# EAGLE design GridEYE-Breakout (EAGLE 6.3)
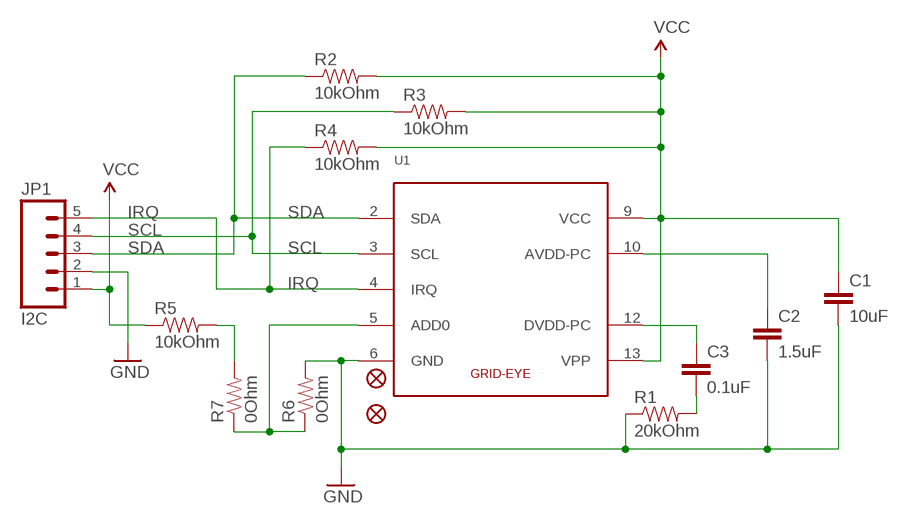
[diagram p0: schematic, sheet 1]

## Parts
C1  10uF  CAP0603-CAP  [0603-CAP]
C2  1.5uF  CAP0603-CAP  [0603-CAP]
C3  0.1uF  CAP0603-CAP  [0603-CAP]
JP1  I2C  M05PTH  [1X05]
JP2  FIDUCIAL1X2  [FIDUCIAL-1X2]
JP3  FIDUCIAL1X2  [FIDUCIAL-1X2]
R1  20kOhm  RESISTOR0603-RES  [0603-RES]
R2  10kOhm  RESISTOR0603-RES  [0603-RES]
R3  10kOhm  RESISTOR0603-RES  [0603-RES]
R4  10kOhm  RESISTOR0603-RES  [0603-RES]
R5  10kOhm  RESISTOR0603-RES  [0603-RES]
R6  0Ohm  RESISTOR0402-RES  [0402-RES]
R7  0Ohm  RESISTOR0402-RES  [0402-RES]
U1  GRID-EYE  [GRID-EYE]

## Nets
ADD0: R6.1 R7.1 U1.5(ADD0)
AVDD: C2.1 U1.10(AVDD-PC)
DVDD: C3.1 U1.12(DVDD-PC)
GND: C1.2 C2.2 JP1.2 R1.1 R6.2 U1.6(GND)
IRQ: JP1.5 R4.1 U1.4(IRQ)
N$2: R5.2 R7.2
N$3: C3.2 R1.2
SCL: JP1.4 R3.1 U1.3(SCL)
SDA: JP1.3 R2.1 U1.2(SDA)
VCC: C1.1 JP1.1 R2.2 R3.2 R4.2 R5.1 U1.9(VCC) U1.13(VPP)

## Library data of the parts
C1-C3 = SparkFun-Capacitors:CAP: Capacitor Standard 0603 ceramic capacitor, and 0.1" leaded capacitor.
JP1 = SparkFun-Connectors:M05: Header 5 Standard 5-pin 0.1" header. Use with straight break away headers (SKU : PRT-00116), right angle break away headers (PRT-00553), swiss pins (PRT-00743), machine pins (PRT-00117), and female headers (PRT-00115). Molex polarized connector foot print use with SKU : PRT-08230 with associated crimp pins and housings.
JP2 JP3 = SparkFun-Aesthetics:FIDUCIAL: Fiducial Alignment Points Various fiducial points for machine vision alignment.
R1-R7 = SparkFun-Resistors:RESISTOR: Resistor Basic schematic elements and footprints for 0603, 1206, and PTH resistors.
U1 = logxen:GRID-EYE

## Board
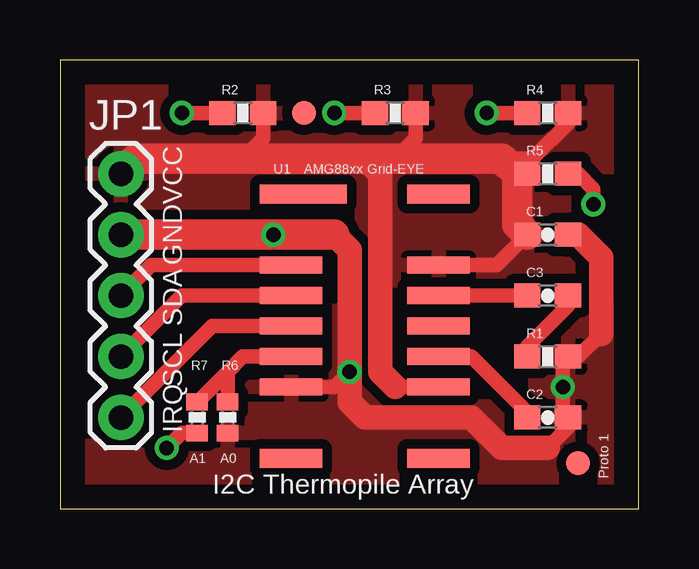
[diagram p1: board, top side]
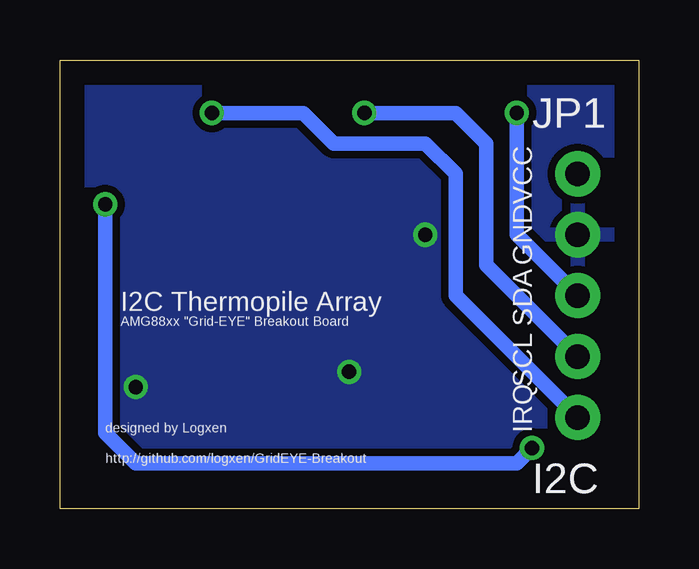
[diagram p2: board, bottom side, seen from below]

Size 24.11 x 18.72 mm. Coordinates in mm from the lower left corner, seen from the top.
Outline: 0,0 24.11,0 24.11,18.72 0,18.72 0,0
Copper layers (1*16): Top 0.035mm / dielectric 1.5mm / Bottom 0.035mm
Design rules "default *": minimum track width 10mil, minimum drill 23mil, track to track 8mil, track to pad 8mil, pad to pad 8mil, via to via 8mil, smd to smd 8mil, copper to edge 40mil, drill to drill 8mil, minimum pad ring 10mil, minimum via ring 8mil, stop-mask expansion 4mil, vias tented up to drill 0mil, thermal gap 10mil

### Footprints (pad centres in the part's own frame; a part is rotated, then mirrored left to right if it is on the bottom)
0603-CAP = smd 1.1 x 1: 1 -0.85,0; 2 0.85,0
1X05 = drill 1.016 pad 1.88: 1 0,0; 2 2.54,0; 3 5.08,0; 4 7.62,0; 5 10.16,0
FIDUCIAL-1X2 = smd 1 x 1: 1 0,0
0603-RES = smd 1.1 x 1: 1 -0.85,0; 2 0.85,0
0402-RES = smd 0.7 x 0.9: 1 -0.65,0; 2 0.65,0
GRID-EYE = smd 0.787 x 3.607: 1 -5.512,-2.565 | smd 0.711 x 2.616: 2 -2.54,-3.073; 3 -1.27,-3.073; 4 0,-3.073; 5 1.27,-3.073; 6 2.54,-3.073; 9 2.54,3.073; 10 1.27,3.073; 11 0,3.073; 12 -1.27,3.073; 13 -2.54,3.073 | smd 0.787 x 2.616: 7 5.512,-3.073; 8 5.512,3.073; 14 -5.512,3.073

### Placement (x,y rotation side)
C1  20.32,11.43 0 top
C2  20.32,3.81 0 top
C3  20.32,8.89 0 top
JP1  2.54,13.97 270 top
JP2  10.16,16.51 0 top
JP3  21.59,1.91 0 top
R1  20.32,6.35 180 top
R2  7.62,16.51 0 top
R3  13.97,16.51 0 top
R4  20.32,16.51 0 top
R5  20.32,13.97 0 top
R6  6.99,3.81 270 top
R7  5.71,3.81 270 top
U1  12.7,7.62 270 top

### Tracks (layer width: path | path; a pad name or v marks a point on that pad's centre or on a via)
ADD0
  Top 0.61: R7.1 5.73,4.46 6.99,5.71 | 6.99,5.71 7.62,6.35 U1.5 | R6.1 6.99,5.71
AVDD
  Top 0.61: U1.10 17.14,6.35 19.47,4.03 C2.1
DVDD
  Top 0.61: U1.12 C3.1
GND  (via drill 0.6)
  Top 0.61: U1.6 11.43,5.08 v12.06,5.71 | 22.54,7.3 21.59,6.35 R1.1 20.95,6.13 v20.95,5.08 20.95,3.81 C2.2 21.17,3.39 20.32,2.54
  Top 1.016: 11.43,11.43 12.06,10.79 v12.06,5.71 12.06,4.45 12.7,3.81 17.14,3.81 18.41,2.54 20.32,2.54 | 22.54,7.3 22.54,10.48 21.59,11.43 C1.2
  Top 1.27: JP1.2 v8.89,11.43 11.43,11.43
  pour Bottom (isolate 0.305): -1.27,20.32 25.4,20.32 25.4,-1.27 -1.27,-1.27
  pour Top (isolate 0.406): -1.27,8.26 25.4,8.26 25.4,-1.27 -1.27,-1.27
IRQ  (via drill 0.6)
  Top 0.61: U1.4 6.35,7.62 JP1.5 | R4.1 v17.78,16.51
  Bottom 0.61: v17.78,16.51 13.97,16.51 12.7,15.24 8.89,15.24 7.62,13.97 7.62,8.89 JP1.5
N$2  (via drill 0.6)
  Top 0.61: R7.2 5.07,3.16 v4.45,2.54 | v22.23,12.7 22.23,13.34 21.59,13.97 R5.2
  Bottom 0.61: v4.45,2.54 5.08,1.91 20.95,1.91 22.23,3.17 v22.23,12.7
N$3
  Top 0.61: C3.2 21.17,8.47 19.47,6.77 R1.2
SCL  (via drill 0.6)
  Top 0.61: U1.3 5.08,8.89 JP1.4 | R3.1 v11.43,16.51
  Bottom 0.61: v11.43,16.51 7.62,16.51 6.35,15.24 6.35,10.16 JP1.4
SDA  (via drill 0.6)
  Top 0.61: U1.2 3.81,10.16 JP1.3 | R2.1 v5.08,16.51
  Bottom 0.61: v5.08,16.51 5.08,11.43 JP1.3
VCC
  Top 0.61: U1.13 18.2,10.16 C1.1 | U1.9 13.97,5.08 | R4.2 21.17,16.09 19.68,14.61 17.78,14.61 | R2.2 8.47,15.46 7.62,14.61 | R3.2 14.82,15.46 13.97,14.61
  Top 1.016: 13.97,5.08 13.34,5.71 13.34,13.97 12.7,14.61
  Top 1.27: JP1.1 3.17,14.61 7.62,14.61 12.7,14.61 13.97,14.61 17.78,14.61 18.41,14.61 19.05,13.97 19.05,11.85 C1.1
  pour Top (isolate 0.406): -1.27,20.32 25.4,20.32 25.4,9.53 -1.27,9.53

### Text on the board
tPlace: AMG88xx Grid-EYE | VCC | GND | SDA | SCL | IRQ | A1 | A0 | I2C Thermopile Array | Proto 1
bPlace: JP1 | VCC | GND | SDA | AMG88xx "Grid-EYE" Breakout Board | I2C Thermopile Array | SCL | IRQ | designed by Logxen | http://github.com/logxen/GridEYE-Breakout | I2C